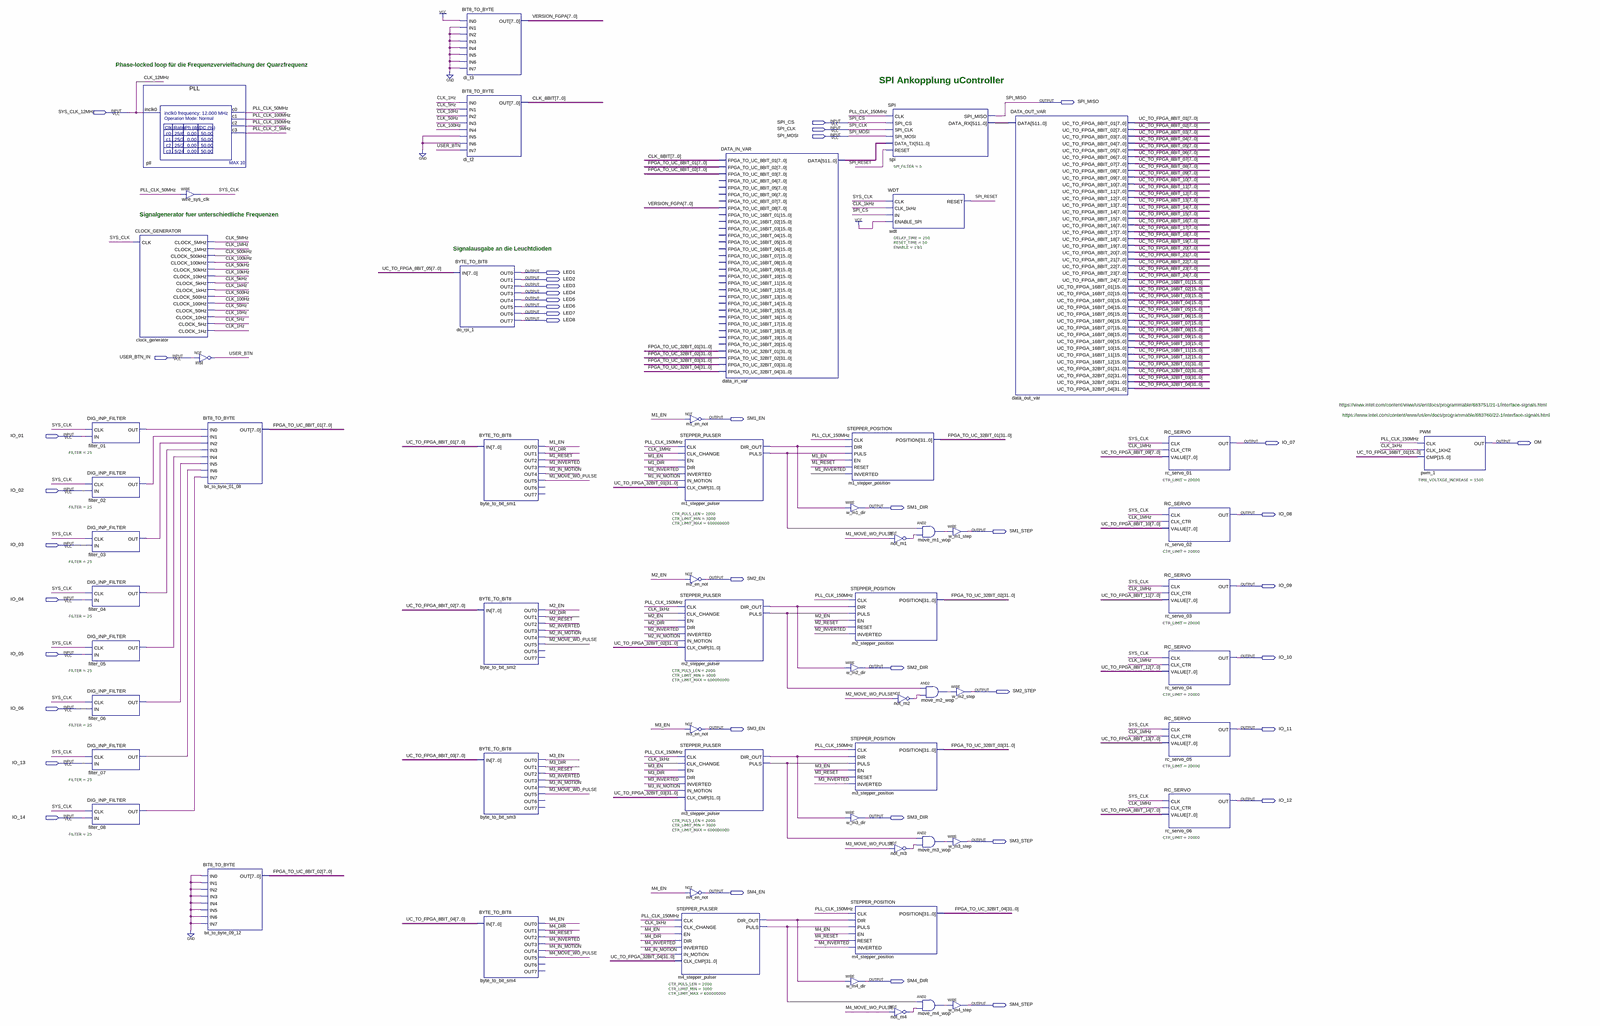
[diagram p0: schematic sheet, whole]
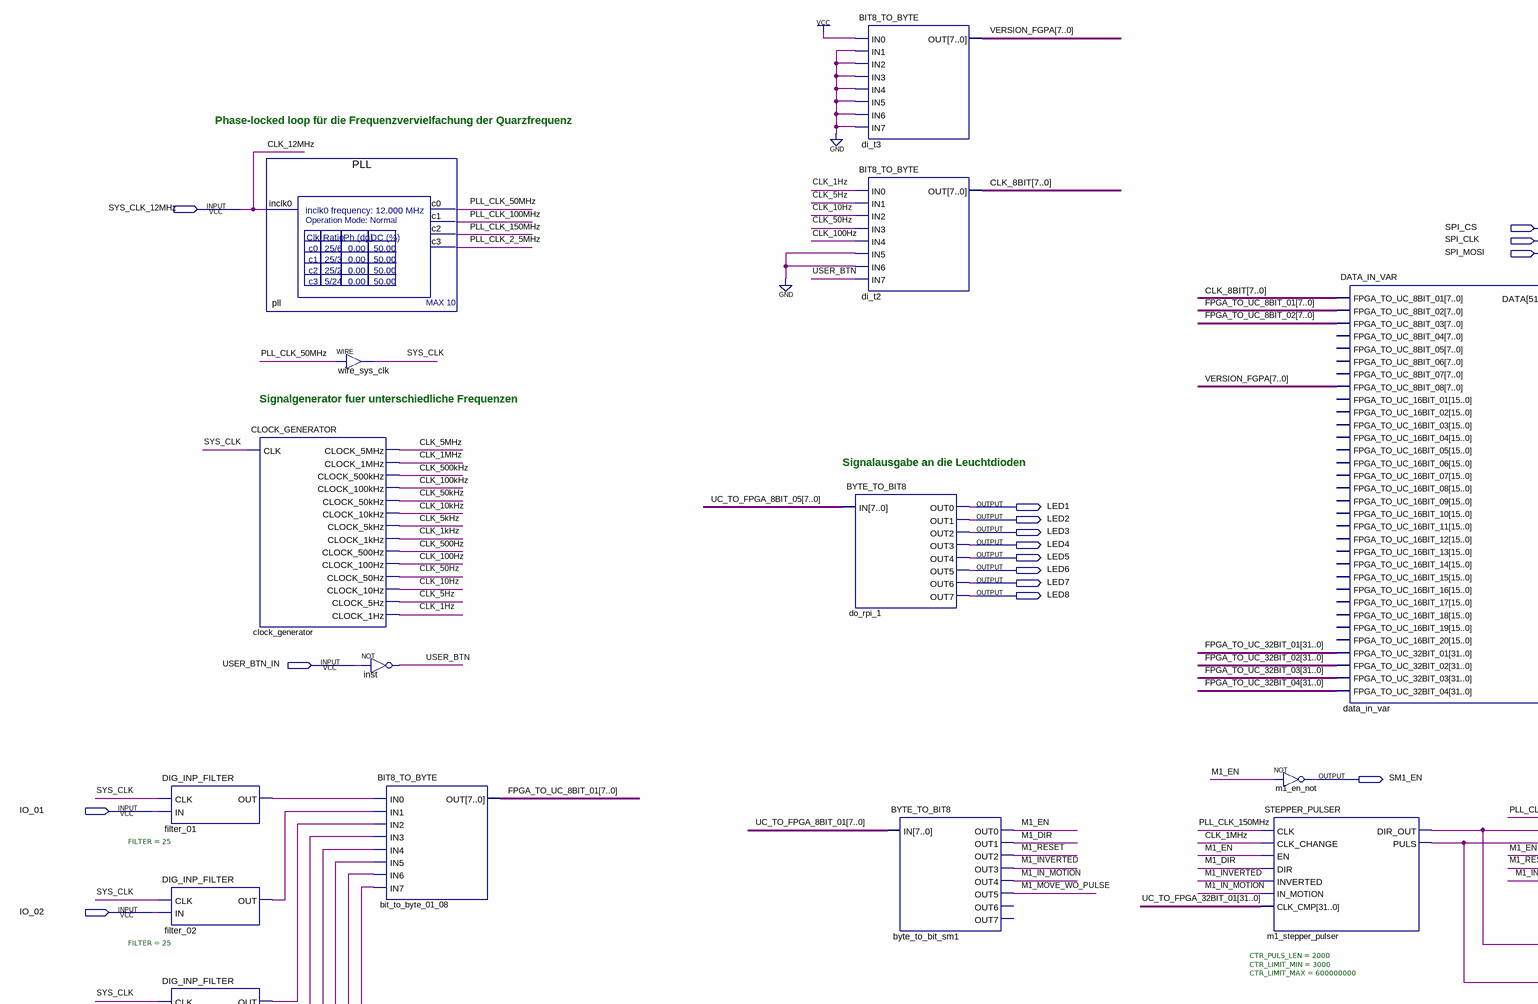
[diagram p1: schematic sheet, upper left part]
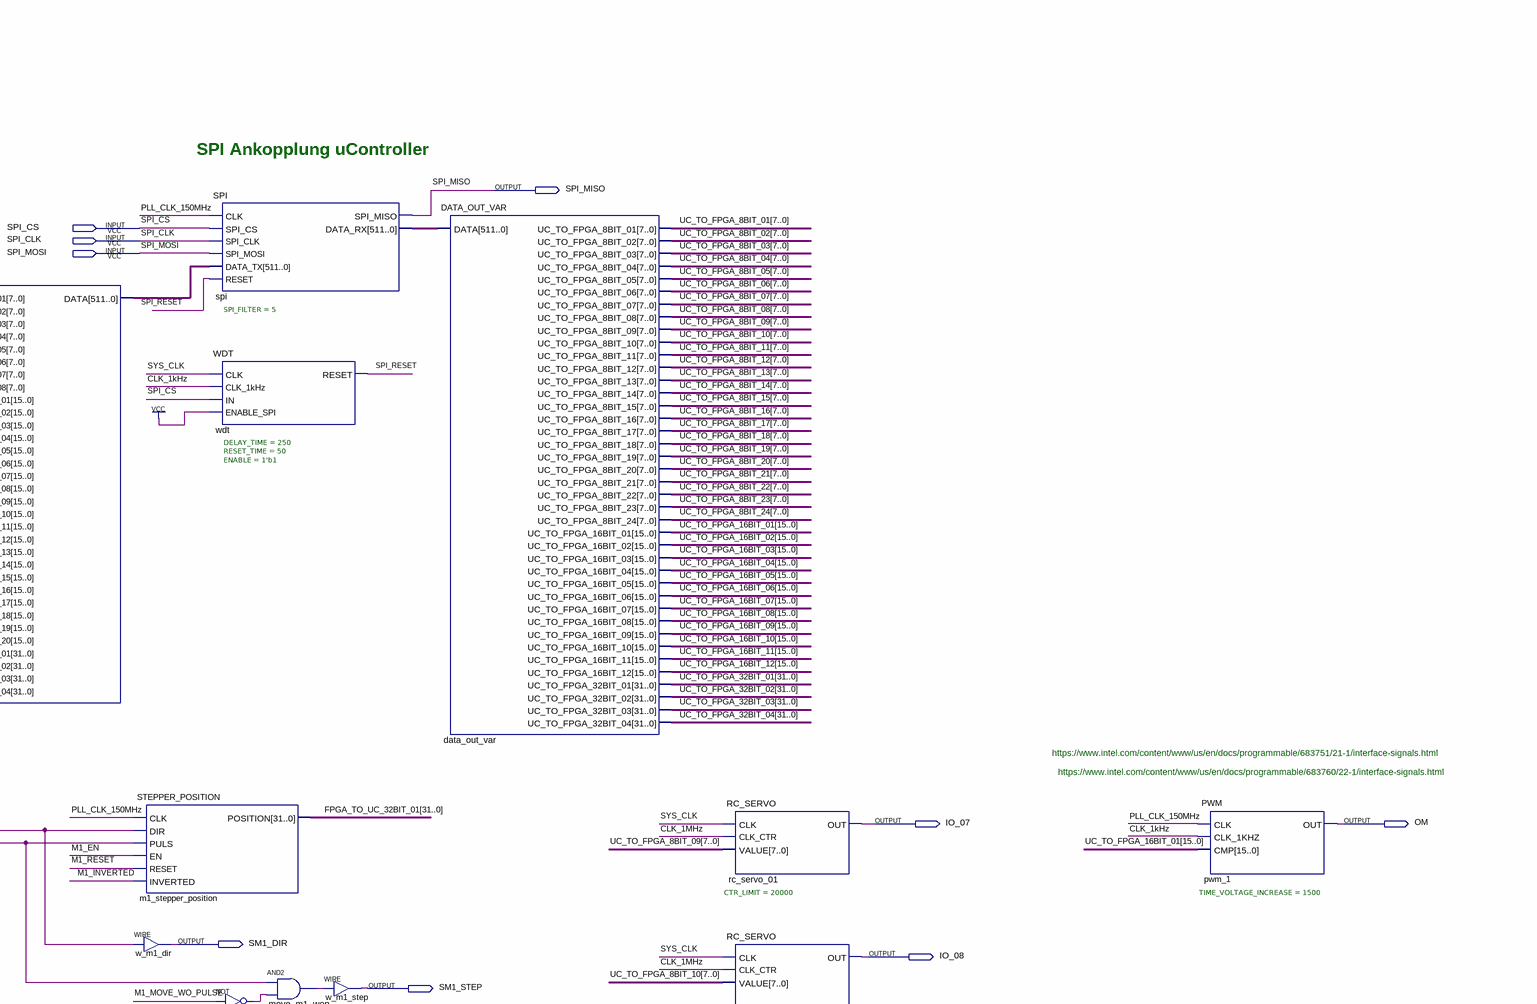
[diagram p2: schematic sheet, upper right part]
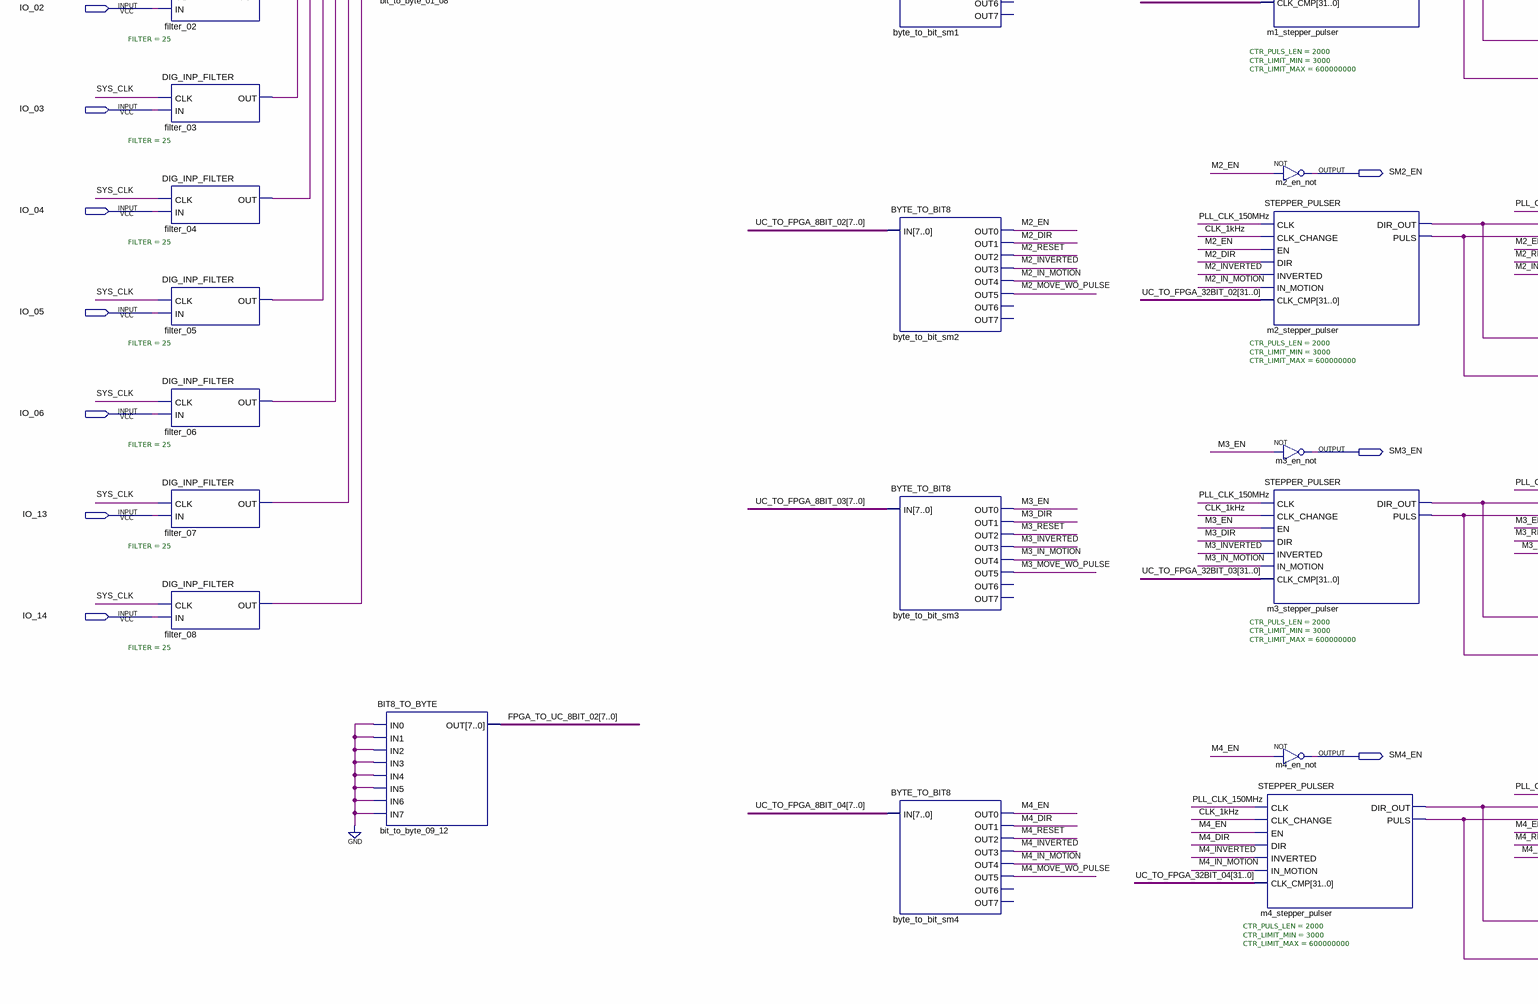
[diagram p3: schematic sheet, lower left part]
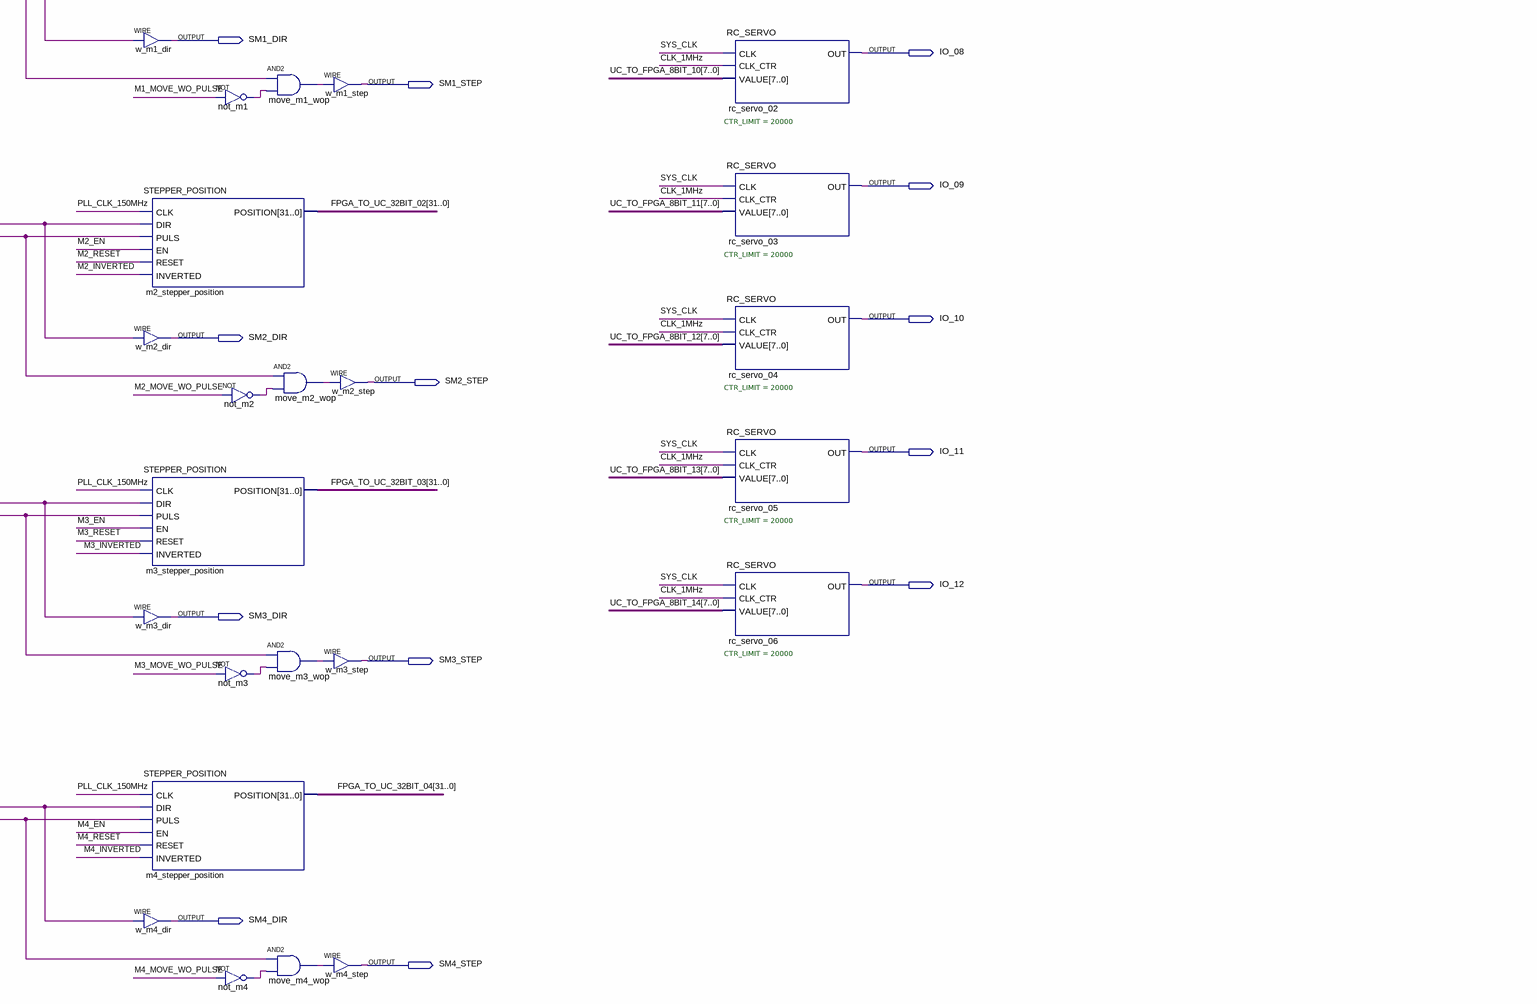
[diagram p4: schematic sheet, lower right part]
// Quartus schematic MAX1000.bdf as structural Verilog: 60 symbols, 41 pins
module MAX1000 (
  input  SYS_CLK_12MHz,
  input  SPI_CS,
  input  SPI_CLK,
  input  SPI_MOSI,
  input  USER_BTN_IN,
  input  IO_01,
  input  IO_02,
  input  IO_03,
  input  IO_04,
  input  IO_05,
  input  IO_06,
  input  IO_13,
  input  IO_14,
  output SPI_MISO,
  output LED1,
  output LED2,
  output LED3,
  output LED4,
  output LED5,
  output LED6,
  output LED7,
  output LED8,
  output SM1_EN,
  output IO_07,
  output OM,
  output SM1_DIR,
  output IO_08,
  output SM1_STEP,
  output SM2_EN,
  output IO_09,
  output IO_10,
  output SM2_DIR,
  output SM2_STEP,
  output SM3_EN,
  output IO_11,
  output IO_12,
  output SM3_DIR,
  output SM3_STEP,
  output SM4_EN,
  output SM4_DIR,
  output SM4_STEP
);

  wire CLK_1Hz, CLK_1kHz, CLK_1MHz, CLK_5Hz, CLK_5kHz, CLK_5MHz, CLK_10Hz, CLK_10kHz, CLK_50Hz, CLK_50kHz,
       CLK_100Hz, CLK_100kHz, CLK_500Hz, CLK_500kHz, filter_01_out, filter_02_out, filter_03_out,
       filter_04_out, filter_05_out, filter_06_out, filter_07_out, filter_08_out, M1_DIR, M1_EN,
       M1_IN_MOTION, M1_INVERTED, M1_MOVE_WO_PULSE, M1_RESET, m1_stepper_pulser_dir_out,
       m1_stepper_pulser_puls, M2_DIR, M2_EN, M2_IN_MOTION, M2_INVERTED, M2_MOVE_WO_PULSE, M2_RESET,
       m2_stepper_pulser_dir_out, m2_stepper_pulser_puls, M3_DIR, M3_EN, M3_IN_MOTION, M3_INVERTED,
       M3_MOVE_WO_PULSE, M3_RESET, m3_stepper_pulser_dir_out, m3_stepper_pulser_puls, M4_DIR, M4_EN,
       M4_IN_MOTION, M4_INVERTED, M4_MOVE_WO_PULSE, M4_RESET, m4_stepper_pulser_dir_out,
       m4_stepper_pulser_puls, move_m1_wop_out, move_m2_wop_out, move_m3_wop_out, move_m4_wop_out,
       not_m1_out, not_m2_out, not_m3_out, not_m4_out, PLL_CLK_2_5MHz, PLL_CLK_50MHz, PLL_CLK_100MHz,
       PLL_CLK_150MHz, SPI_RESET, SYS_CLK, USER_BTN;
  wire [7:0] CLK_8BIT, FPGA_TO_UC_8BIT_01, FPGA_TO_UC_8BIT_02, UC_TO_FPGA_8BIT_01, UC_TO_FPGA_8BIT_02,
       UC_TO_FPGA_8BIT_03, UC_TO_FPGA_8BIT_04, UC_TO_FPGA_8BIT_05, UC_TO_FPGA_8BIT_06, UC_TO_FPGA_8BIT_07,
       UC_TO_FPGA_8BIT_08, UC_TO_FPGA_8BIT_09, UC_TO_FPGA_8BIT_10, UC_TO_FPGA_8BIT_11, UC_TO_FPGA_8BIT_12,
       UC_TO_FPGA_8BIT_13, UC_TO_FPGA_8BIT_14, UC_TO_FPGA_8BIT_15, UC_TO_FPGA_8BIT_16, UC_TO_FPGA_8BIT_17,
       UC_TO_FPGA_8BIT_18, UC_TO_FPGA_8BIT_19, UC_TO_FPGA_8BIT_20, UC_TO_FPGA_8BIT_21, UC_TO_FPGA_8BIT_22,
       UC_TO_FPGA_8BIT_23, UC_TO_FPGA_8BIT_24, VERSION_FGPA;
  wire [15:0] UC_TO_FPGA_16BIT_01, UC_TO_FPGA_16BIT_02, UC_TO_FPGA_16BIT_03, UC_TO_FPGA_16BIT_04,
       UC_TO_FPGA_16BIT_05, UC_TO_FPGA_16BIT_06, UC_TO_FPGA_16BIT_07, UC_TO_FPGA_16BIT_08,
       UC_TO_FPGA_16BIT_09, UC_TO_FPGA_16BIT_10, UC_TO_FPGA_16BIT_11, UC_TO_FPGA_16BIT_12;
  wire [31:0] FPGA_TO_UC_32BIT_01, FPGA_TO_UC_32BIT_02, FPGA_TO_UC_32BIT_03, FPGA_TO_UC_32BIT_04,
       UC_TO_FPGA_32BIT_01, UC_TO_FPGA_32BIT_02, UC_TO_FPGA_32BIT_03, UC_TO_FPGA_32BIT_04;
  wire [511:0] data_in_var_data, spi_data_rx;

  DIG_INP_FILTER #(.FILTER(25)) filter_01 (.CLK(SYS_CLK), .IN(IO_01), .OUT(filter_01_out));
  DIG_INP_FILTER #(.FILTER(25)) filter_02 (.CLK(SYS_CLK), .IN(IO_02), .OUT(filter_02_out));
  DIG_INP_FILTER #(.FILTER(25)) filter_03 (.CLK(SYS_CLK), .IN(IO_03), .OUT(filter_03_out));
  DIG_INP_FILTER #(.FILTER(25)) filter_04 (.CLK(SYS_CLK), .IN(IO_04), .OUT(filter_04_out));
  DIG_INP_FILTER #(.FILTER(25)) filter_05 (.CLK(SYS_CLK), .IN(IO_05), .OUT(filter_05_out));
  DIG_INP_FILTER #(.FILTER(25)) filter_06 (.CLK(SYS_CLK), .IN(IO_06), .OUT(filter_06_out));
  DIG_INP_FILTER #(.FILTER(25)) filter_07 (.CLK(SYS_CLK), .IN(IO_13), .OUT(filter_07_out));
  DIG_INP_FILTER #(.FILTER(25)) filter_08 (.CLK(SYS_CLK), .IN(IO_14), .OUT(filter_08_out));
  PLL pll (.inclk0(SYS_CLK_12MHz), .c0(PLL_CLK_50MHz), .c1(PLL_CLK_100MHz), .c2(PLL_CLK_150MHz), .c3(PLL_CLK_2_5MHz));
  CLOCK_GENERATOR clock_generator (
    .CLK(SYS_CLK), .CLOCK_5MHz(CLK_5MHz), .CLOCK_1MHz(CLK_1MHz), .CLOCK_500kHz(CLK_500kHz),
    .CLOCK_100kHz(CLK_100kHz), .CLOCK_50kHz(CLK_50kHz), .CLOCK_10kHz(CLK_10kHz), .CLOCK_5kHz(CLK_5kHz),
    .CLOCK_1kHz(CLK_1kHz), .CLOCK_500Hz(CLK_500Hz), .CLOCK_100Hz(CLK_100Hz), .CLOCK_50Hz(CLK_50Hz),
    .CLOCK_10Hz(CLK_10Hz), .CLOCK_5Hz(CLK_5Hz), .CLOCK_1Hz(CLK_1Hz));
  assign SYS_CLK = PLL_CLK_50MHz;  // WIRE wire_sys_clk
  not inst (USER_BTN, USER_BTN_IN);
  BIT8_TO_BYTE bit_to_byte_01_08 (
    .IN0(filter_01_out), .IN1(filter_02_out), .IN2(filter_03_out), .IN3(filter_04_out), .IN4(filter_05_out),
    .IN5(filter_06_out), .IN6(filter_07_out), .IN7(filter_08_out), .OUT(FPGA_TO_UC_8BIT_01));
  BIT8_TO_BYTE bit_to_byte_09_12 (
    .IN0(1'b0), .IN1(1'b0), .IN2(1'b0), .IN3(1'b0), .IN4(1'b0), .IN5(1'b0), .IN6(1'b0), .IN7(1'b0),
    .OUT(FPGA_TO_UC_8BIT_02));
  BYTE_TO_BIT8 do_rpi_1 (
    .IN(UC_TO_FPGA_8BIT_05), .OUT0(LED1), .OUT1(LED2), .OUT2(LED3), .OUT3(LED4), .OUT4(LED5), .OUT5(LED6),
    .OUT6(LED7), .OUT7(LED8));
  BIT8_TO_BYTE di_t3 (
    .IN0(1'b1), .IN1(1'b0), .IN2(1'b0), .IN3(1'b0), .IN4(1'b0), .IN5(1'b0), .IN6(1'b0), .IN7(1'b0),
    .OUT(VERSION_FGPA));
  BIT8_TO_BYTE di_t2 (
    .IN0(CLK_1Hz), .IN1(CLK_5Hz), .IN2(CLK_10Hz), .IN3(CLK_50Hz), .IN4(CLK_100Hz), .IN5(1'b0), .IN6(1'b0),
    .IN7(USER_BTN), .OUT(CLK_8BIT));
  BYTE_TO_BIT8 byte_to_bit_sm1 (
    .IN(UC_TO_FPGA_8BIT_01), .OUT0(M1_EN), .OUT1(M1_DIR), .OUT2(M1_RESET), .OUT3(M1_INVERTED),
    .OUT4(M1_IN_MOTION), .OUT5(M1_MOVE_WO_PULSE));  // open: OUT6, OUT7
  BYTE_TO_BIT8 byte_to_bit_sm2 (
    .IN(UC_TO_FPGA_8BIT_02), .OUT0(M2_EN), .OUT1(M2_DIR), .OUT2(M2_RESET), .OUT3(M2_INVERTED),
    .OUT4(M2_IN_MOTION), .OUT5(M2_MOVE_WO_PULSE));  // open: OUT6, OUT7
  BYTE_TO_BIT8 byte_to_bit_sm3 (
    .IN(UC_TO_FPGA_8BIT_03), .OUT0(M3_EN), .OUT1(M3_DIR), .OUT2(M3_RESET), .OUT3(M3_INVERTED),
    .OUT4(M3_IN_MOTION), .OUT5(M3_MOVE_WO_PULSE));  // open: OUT6, OUT7
  BYTE_TO_BIT8 byte_to_bit_sm4 (
    .IN(UC_TO_FPGA_8BIT_04), .OUT0(M4_EN), .OUT1(M4_DIR), .OUT2(M4_RESET), .OUT3(M4_INVERTED),
    .OUT4(M4_IN_MOTION), .OUT5(M4_MOVE_WO_PULSE));  // open: OUT6, OUT7
  STEPPER_PULSER #(.CTR_PULS_LEN(2000), .CTR_LIMIT_MIN(3000), .CTR_LIMIT_MAX(600000000)) m4_stepper_pulser (
    .CLK(PLL_CLK_150MHz), .CLK_CHANGE(CLK_1kHz), .EN(M4_EN), .DIR(M4_DIR), .INVERTED(M4_INVERTED),
    .IN_MOTION(M4_IN_MOTION), .CLK_CMP(UC_TO_FPGA_32BIT_04), .DIR_OUT(m4_stepper_pulser_dir_out),
    .PULS(m4_stepper_pulser_puls));
  not m1_en_not (SM1_EN, M1_EN);
  STEPPER_PULSER #(.CTR_PULS_LEN(2000), .CTR_LIMIT_MIN(3000), .CTR_LIMIT_MAX(600000000)) m1_stepper_pulser (
    .CLK(PLL_CLK_150MHz), .CLK_CHANGE(CLK_1MHz), .EN(M1_EN), .DIR(M1_DIR), .INVERTED(M1_INVERTED),
    .IN_MOTION(M1_IN_MOTION), .CLK_CMP(UC_TO_FPGA_32BIT_01), .DIR_OUT(m1_stepper_pulser_dir_out),
    .PULS(m1_stepper_pulser_puls));
  not m2_en_not (SM2_EN, M2_EN);
  STEPPER_PULSER #(.CTR_PULS_LEN(2000), .CTR_LIMIT_MIN(3000), .CTR_LIMIT_MAX(600000000)) m2_stepper_pulser (
    .CLK(PLL_CLK_150MHz), .CLK_CHANGE(CLK_1kHz), .EN(M2_EN), .DIR(M2_DIR), .INVERTED(M2_INVERTED),
    .IN_MOTION(M2_IN_MOTION), .CLK_CMP(UC_TO_FPGA_32BIT_02), .DIR_OUT(m2_stepper_pulser_dir_out),
    .PULS(m2_stepper_pulser_puls));
  not m3_en_not (SM3_EN, M3_EN);
  STEPPER_PULSER #(.CTR_PULS_LEN(2000), .CTR_LIMIT_MIN(3000), .CTR_LIMIT_MAX(600000000)) m3_stepper_pulser (
    .CLK(PLL_CLK_150MHz), .CLK_CHANGE(CLK_1kHz), .EN(M3_EN), .DIR(M3_DIR), .INVERTED(M3_INVERTED),
    .IN_MOTION(M3_IN_MOTION), .CLK_CMP(UC_TO_FPGA_32BIT_03), .DIR_OUT(m3_stepper_pulser_dir_out),
    .PULS(m3_stepper_pulser_puls));
  not m4_en_not (SM4_EN, M4_EN);
  DATA_IN_VAR data_in_var (
    .FPGA_TO_UC_8BIT_01(CLK_8BIT), .FPGA_TO_UC_8BIT_02(FPGA_TO_UC_8BIT_01),
    .FPGA_TO_UC_8BIT_03(FPGA_TO_UC_8BIT_02), .FPGA_TO_UC_8BIT_08(VERSION_FGPA),
    .FPGA_TO_UC_32BIT_01(FPGA_TO_UC_32BIT_01), .FPGA_TO_UC_32BIT_02(FPGA_TO_UC_32BIT_02),
    .FPGA_TO_UC_32BIT_03(FPGA_TO_UC_32BIT_03), .FPGA_TO_UC_32BIT_04(FPGA_TO_UC_32BIT_04),
    .DATA(data_in_var_data));  // open: FPGA_TO_UC_8BIT_04, FPGA_TO_UC_8BIT_05, FPGA_TO_UC_8BIT_06, FPGA_TO_UC_8BIT_07, FPGA_TO_UC_16BIT_01, FPGA_TO_UC_16BIT_02, FPGA_TO_UC_16BIT_03, FPGA_TO_UC_16BIT_04, FPGA_TO_UC_16BIT_05, FPGA_TO_UC_16BIT_06, FPGA_TO_UC_16BIT_07, FPGA_TO_UC_16BIT_08, FPGA_TO_UC_16BIT_09, FPGA_TO_UC_16BIT_10, FPGA_TO_UC_16BIT_11, FPGA_TO_UC_16BIT_12, FPGA_TO_UC_16BIT_13, FPGA_TO_UC_16BIT_14, FPGA_TO_UC_16BIT_15, FPGA_TO_UC_16BIT_16, FPGA_TO_UC_16BIT_17, FPGA_TO_UC_16BIT_18, FPGA_TO_UC_16BIT_19, FPGA_TO_UC_16BIT_20
  STEPPER_POSITION m1_stepper_position (
    .CLK(PLL_CLK_150MHz), .DIR(m1_stepper_pulser_dir_out), .PULS(m1_stepper_pulser_puls), .EN(M1_EN),
    .RESET(M1_RESET), .INVERTED(M1_INVERTED), .POSITION(FPGA_TO_UC_32BIT_01));
  assign SM1_DIR = m1_stepper_pulser_dir_out;  // WIRE w_m1_dir
  STEPPER_POSITION m2_stepper_position (
    .CLK(PLL_CLK_150MHz), .DIR(m2_stepper_pulser_dir_out), .PULS(m2_stepper_pulser_puls), .EN(M2_EN),
    .RESET(M2_RESET), .INVERTED(M2_INVERTED), .POSITION(FPGA_TO_UC_32BIT_02));
  assign SM2_DIR = m2_stepper_pulser_dir_out;  // WIRE w_m2_dir
  STEPPER_POSITION m3_stepper_position (
    .CLK(PLL_CLK_150MHz), .DIR(m3_stepper_pulser_dir_out), .PULS(m3_stepper_pulser_puls), .EN(M3_EN),
    .RESET(M3_RESET), .INVERTED(M3_INVERTED), .POSITION(FPGA_TO_UC_32BIT_03));
  assign SM3_DIR = m3_stepper_pulser_dir_out;  // WIRE w_m3_dir
  STEPPER_POSITION m4_stepper_position (
    .CLK(PLL_CLK_150MHz), .DIR(m4_stepper_pulser_dir_out), .PULS(m4_stepper_pulser_puls), .EN(M4_EN),
    .RESET(M4_RESET), .INVERTED(M4_INVERTED), .POSITION(FPGA_TO_UC_32BIT_04));
  assign SM4_DIR = m4_stepper_pulser_dir_out;  // WIRE w_m4_dir
  SPI #(.SPI_FILTER(5)) spi (
    .CLK(PLL_CLK_150MHz), .SPI_CS(SPI_CS), .SPI_CLK(SPI_CLK), .SPI_MOSI(SPI_MOSI),
    .DATA_TX(data_in_var_data), .RESET(SPI_RESET), .SPI_MISO(SPI_MISO), .DATA_RX(spi_data_rx));
  WDT #(.DELAY_TIME(250), .RESET_TIME(50), .ENABLE(1'b1)) wdt (
    .CLK(SYS_CLK), .CLK_1kHz(CLK_1kHz), .IN(SPI_CS), .ENABLE_SPI(1'b1), .RESET(SPI_RESET));
  not not_m1 (not_m1_out, M1_MOVE_WO_PULSE);
  not not_m2 (not_m2_out, M2_MOVE_WO_PULSE);
  not not_m3 (not_m3_out, M3_MOVE_WO_PULSE);
  not not_m4 (not_m4_out, M4_MOVE_WO_PULSE);
  and move_m1_wop (move_m1_wop_out, m1_stepper_pulser_puls, not_m1_out);
  and move_m2_wop (move_m2_wop_out, m2_stepper_pulser_puls, not_m2_out);
  and move_m3_wop (move_m3_wop_out, m3_stepper_pulser_puls, not_m3_out);
  and move_m4_wop (move_m4_wop_out, m4_stepper_pulser_puls, not_m4_out);
  assign SM1_STEP = move_m1_wop_out;  // WIRE w_m1_step
  assign SM3_STEP = move_m3_wop_out;  // WIRE w_m3_step
  assign SM4_STEP = move_m4_wop_out;  // WIRE w_m4_step
  assign SM2_STEP = move_m2_wop_out;  // WIRE w_m2_step
  DATA_OUT_VAR data_out_var (
    .DATA(spi_data_rx), .UC_TO_FPGA_8BIT_01(UC_TO_FPGA_8BIT_01), .UC_TO_FPGA_8BIT_02(UC_TO_FPGA_8BIT_02),
    .UC_TO_FPGA_8BIT_03(UC_TO_FPGA_8BIT_03), .UC_TO_FPGA_8BIT_04(UC_TO_FPGA_8BIT_04),
    .UC_TO_FPGA_8BIT_05(UC_TO_FPGA_8BIT_05), .UC_TO_FPGA_8BIT_06(UC_TO_FPGA_8BIT_06),
    .UC_TO_FPGA_8BIT_07(UC_TO_FPGA_8BIT_07), .UC_TO_FPGA_8BIT_08(UC_TO_FPGA_8BIT_08),
    .UC_TO_FPGA_8BIT_09(UC_TO_FPGA_8BIT_09), .UC_TO_FPGA_8BIT_10(UC_TO_FPGA_8BIT_10),
    .UC_TO_FPGA_8BIT_11(UC_TO_FPGA_8BIT_11), .UC_TO_FPGA_8BIT_12(UC_TO_FPGA_8BIT_12),
    .UC_TO_FPGA_8BIT_13(UC_TO_FPGA_8BIT_13), .UC_TO_FPGA_8BIT_14(UC_TO_FPGA_8BIT_14),
    .UC_TO_FPGA_8BIT_15(UC_TO_FPGA_8BIT_15), .UC_TO_FPGA_8BIT_16(UC_TO_FPGA_8BIT_16),
    .UC_TO_FPGA_8BIT_17(UC_TO_FPGA_8BIT_17), .UC_TO_FPGA_8BIT_18(UC_TO_FPGA_8BIT_18),
    .UC_TO_FPGA_8BIT_19(UC_TO_FPGA_8BIT_19), .UC_TO_FPGA_8BIT_20(UC_TO_FPGA_8BIT_20),
    .UC_TO_FPGA_8BIT_21(UC_TO_FPGA_8BIT_21), .UC_TO_FPGA_8BIT_22(UC_TO_FPGA_8BIT_22),
    .UC_TO_FPGA_8BIT_23(UC_TO_FPGA_8BIT_23), .UC_TO_FPGA_8BIT_24(UC_TO_FPGA_8BIT_24),
    .UC_TO_FPGA_16BIT_01(UC_TO_FPGA_16BIT_01), .UC_TO_FPGA_16BIT_02(UC_TO_FPGA_16BIT_02),
    .UC_TO_FPGA_16BIT_03(UC_TO_FPGA_16BIT_03), .UC_TO_FPGA_16BIT_04(UC_TO_FPGA_16BIT_04),
    .UC_TO_FPGA_16BIT_05(UC_TO_FPGA_16BIT_05), .UC_TO_FPGA_16BIT_06(UC_TO_FPGA_16BIT_06),
    .UC_TO_FPGA_16BIT_07(UC_TO_FPGA_16BIT_07), .UC_TO_FPGA_16BIT_08(UC_TO_FPGA_16BIT_08),
    .UC_TO_FPGA_16BIT_09(UC_TO_FPGA_16BIT_09), .UC_TO_FPGA_16BIT_10(UC_TO_FPGA_16BIT_10),
    .UC_TO_FPGA_16BIT_11(UC_TO_FPGA_16BIT_11), .UC_TO_FPGA_16BIT_12(UC_TO_FPGA_16BIT_12),
    .UC_TO_FPGA_32BIT_01(UC_TO_FPGA_32BIT_01), .UC_TO_FPGA_32BIT_02(UC_TO_FPGA_32BIT_02),
    .UC_TO_FPGA_32BIT_03(UC_TO_FPGA_32BIT_03), .UC_TO_FPGA_32BIT_04(UC_TO_FPGA_32BIT_04));
  RC_SERVO #(.CTR_LIMIT(20000)) rc_servo_01 (
    .CLK(SYS_CLK), .CLK_CTR(CLK_1MHz), .VALUE(UC_TO_FPGA_8BIT_09), .OUT(IO_07));
  RC_SERVO #(.CTR_LIMIT(20000)) rc_servo_02 (
    .CLK(SYS_CLK), .CLK_CTR(CLK_1MHz), .VALUE(UC_TO_FPGA_8BIT_10), .OUT(IO_08));
  RC_SERVO #(.CTR_LIMIT(20000)) rc_servo_03 (
    .CLK(SYS_CLK), .CLK_CTR(CLK_1MHz), .VALUE(UC_TO_FPGA_8BIT_11), .OUT(IO_09));
  RC_SERVO #(.CTR_LIMIT(20000)) rc_servo_04 (
    .CLK(SYS_CLK), .CLK_CTR(CLK_1MHz), .VALUE(UC_TO_FPGA_8BIT_12), .OUT(IO_10));
  RC_SERVO #(.CTR_LIMIT(20000)) rc_servo_05 (
    .CLK(SYS_CLK), .CLK_CTR(CLK_1MHz), .VALUE(UC_TO_FPGA_8BIT_13), .OUT(IO_11));
  RC_SERVO #(.CTR_LIMIT(20000)) rc_servo_06 (
    .CLK(SYS_CLK), .CLK_CTR(CLK_1MHz), .VALUE(UC_TO_FPGA_8BIT_14), .OUT(IO_12));
  PWM #(.TIME_VOLTAGE_INCREASE(1500)) pwm_1 (
    .CLK(PLL_CLK_150MHz), .CLK_1KHZ(CLK_1kHz), .CMP(UC_TO_FPGA_16BIT_01), .OUT(OM));

  // Other names for the same wires on the sheet: CLK_12MHz = SYS_CLK_12MHz

  // Notes on the sheet:
  //   Phase-locked loop für die Frequenzvervielfachung der Quarzfrequenz
  //   SPI Ankopplung uController
  //   Signalgenerator fuer unterschiedliche Frequenzen
  //   Signalausgabe an die Leuchtdioden
  //   https://www.intel.com/content/www/us/en/docs/programmable/683751/21-1/interface-signals.html
  //   https://www.intel.com/content/www/us/en/docs/programmable/683760/22-1/interface-signals.html
endmodule
